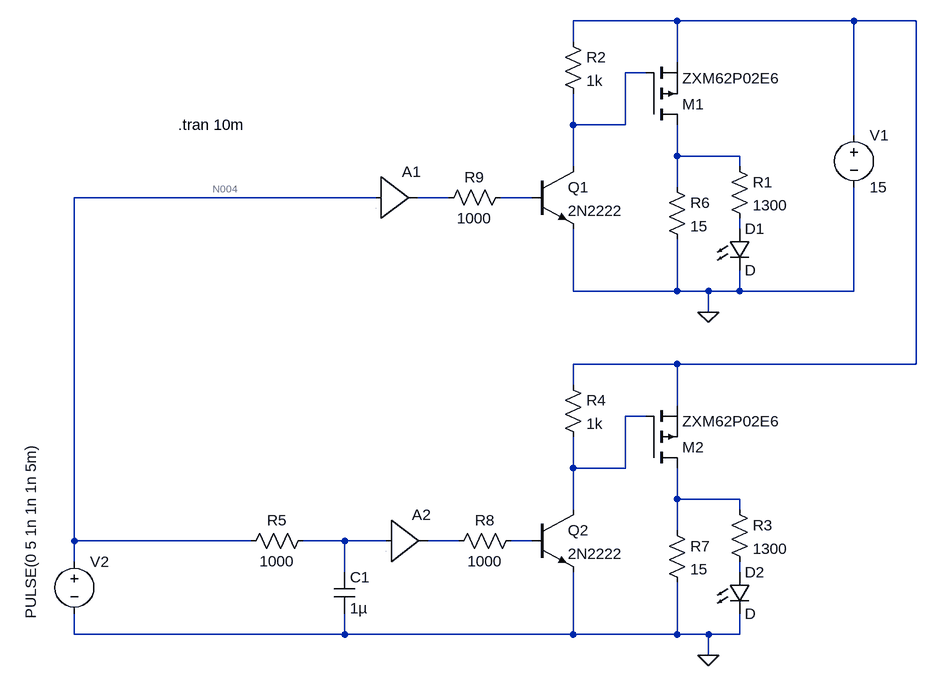
[diagram p0: schematic dc-contactor-driver-mosfet-p.asc]
dc-contactor-driver-mosfet-p.asc, the LTspice schematic file:
Version 4
SHEET 1 880 1128
WIRE 80 16 -80 16
WIRE 352 16 80 16
WIRE 448 16 352 16
WIRE -80 48 -80 16
WIRE 80 80 80 16
WIRE 32 96 0 96
WIRE -80 176 -80 128
WIRE 0 176 0 96
WIRE 0 176 -80 176
WIRE 352 192 352 16
WIRE 80 224 80 176
WIRE 176 224 80 224
WIRE -80 240 -80 176
WIRE 176 240 176 224
WIRE 80 272 80 224
WIRE -384 288 -848 288
WIRE -272 288 -320 288
WIRE -144 288 -192 288
WIRE 176 336 176 320
WIRE -80 432 -80 336
WIRE 80 432 80 352
WIRE 80 432 -80 432
WIRE 128 432 80 432
WIRE 176 432 176 400
WIRE 176 432 128 432
WIRE 352 432 352 272
WIRE 352 432 176 432
WIRE 128 464 128 432
WIRE 80 544 -80 544
WIRE 448 544 448 16
WIRE 448 544 80 544
WIRE -80 576 -80 544
WIRE 80 608 80 544
WIRE 32 624 0 624
WIRE -80 704 -80 656
WIRE 0 704 0 624
WIRE 0 704 -80 704
WIRE 80 752 80 704
WIRE 176 752 80 752
WIRE -80 768 -80 704
WIRE 176 768 176 752
WIRE 80 800 80 752
WIRE -848 816 -848 288
WIRE -576 816 -848 816
WIRE -432 816 -496 816
WIRE -368 816 -432 816
WIRE -256 816 -304 816
WIRE -144 816 -176 816
WIRE -848 848 -848 816
WIRE -432 864 -432 816
WIRE 176 864 176 848
WIRE -848 960 -848 928
WIRE -432 960 -432 928
WIRE -432 960 -848 960
WIRE -80 960 -80 864
WIRE -80 960 -432 960
WIRE 80 960 80 880
WIRE 80 960 -80 960
WIRE 128 960 80 960
WIRE 176 960 176 928
WIRE 176 960 128 960
WIRE 128 992 128 960
FLAG 128 464 0
FLAG 128 992 0
SYMBOL pmos 32 176 M180
SYMATTR InstName M1
SYMATTR Value ZXM62P02E6
SYMBOL res 160 224 R0
SYMATTR InstName R1
SYMATTR Value 1300
SYMBOL LED 160 336 R0
SYMATTR InstName D1
SYMBOL voltage 352 176 R0
WINDOW 123 0 0 Left 0
WINDOW 39 0 0 Left 0
SYMATTR InstName V1
SYMATTR Value 15
SYMBOL res -96 32 R0
SYMATTR InstName R2
SYMATTR Value 1k
SYMBOL npn -144 240 R0
SYMATTR InstName Q1
SYMATTR Value 2N2222
SYMBOL pmos 32 704 M180
SYMATTR InstName M2
SYMATTR Value ZXM62P02E6
SYMBOL res 160 752 R0
SYMATTR InstName R3
SYMATTR Value 1300
SYMBOL LED 160 864 R0
SYMATTR InstName D2
SYMBOL res -96 560 R0
SYMATTR InstName R4
SYMATTR Value 1k
SYMBOL npn -144 768 R0
SYMATTR InstName Q2
SYMATTR Value 2N2222
SYMBOL Digital\\buf1 -368 752 R0
WINDOW 3 0 0 Invisible 0
SYMATTR Value Vhigh = 5,Vt = 1.4, Vh = 0.8
SYMATTR InstName A2
SYMBOL res -480 800 R90
WINDOW 0 0 56 VBottom 2
WINDOW 3 32 56 VTop 2
SYMATTR InstName R5
SYMATTR Value 1000
SYMBOL cap -448 864 R0
SYMATTR InstName C1
SYMATTR Value 1µ
SYMBOL voltage -848 832 R0
WINDOW 3 -67 -166 VRight 2
WINDOW 123 0 0 Left 0
WINDOW 39 0 0 Left 0
SYMATTR Value PULSE(0 5 1n 1n 1n 5m)
SYMATTR InstName V2
SYMBOL res 64 256 R0
SYMATTR InstName R6
SYMATTR Value 15
SYMBOL res 64 784 R0
SYMATTR InstName R7
SYMATTR Value 15
SYMBOL res -272 832 R270
WINDOW 0 32 56 VTop 2
WINDOW 3 0 56 VBottom 2
SYMATTR InstName R8
SYMATTR Value 1000
SYMBOL res -288 304 R270
WINDOW 0 32 56 VTop 2
WINDOW 3 0 56 VBottom 2
SYMATTR InstName R9
SYMATTR Value 1000
SYMBOL Digital\\buf1 -384 224 R0
WINDOW 3 0 0 Invisible 0
SYMATTR Value Vhigh = 5,Vt = 1.4, Vh = 0.8
SYMATTR InstName A1
TEXT -688 176 Left 2 !.tran 10m

The netlist it stands for:
* dc-contactor-driver-mosfet-p.asc
M1 N003 N002 N001 N001 ZXM62P02E6
R1 N003 N007 1300
D1 N007 0 D
V1 N001 0 15
R2 N001 N002 1k
Q1 N002 N006 0 0 2N2222
M2 N009 N008 N001 N001 ZXM62P02E6
R3 N009 N013 1300
D2 N013 0 D
R4 N001 N008 1k
Q2 N008 N012 0 0 2N2222
A2 N010 0 0 0 0 0 N011 0 BUF Vhigh = 5,Vt = 1.4, Vh = 0.8
R5 N010 N004 1000
C1 N010 0 1µ
V2 N004 0 PULSE(0 5 1n 1n 1n 5m)
R6 N003 0 15
R7 N009 0 15
R8 N011 N012 1000
R9 N005 N006 1000
A1 N004 0 0 0 0 0 N005 0 BUF Vhigh = 5,Vt = 1.4, Vh = 0.8
.model D D
.lib standard.dio
.model NPN NPN
.model PNP PNP
.lib standard.bjt
.model NMOS NMOS
.model PMOS PMOS
.lib standard.mos
.tran 10m
.backanno
.end

* Results of the author's LTspice run, read from the files saved beside the schematic
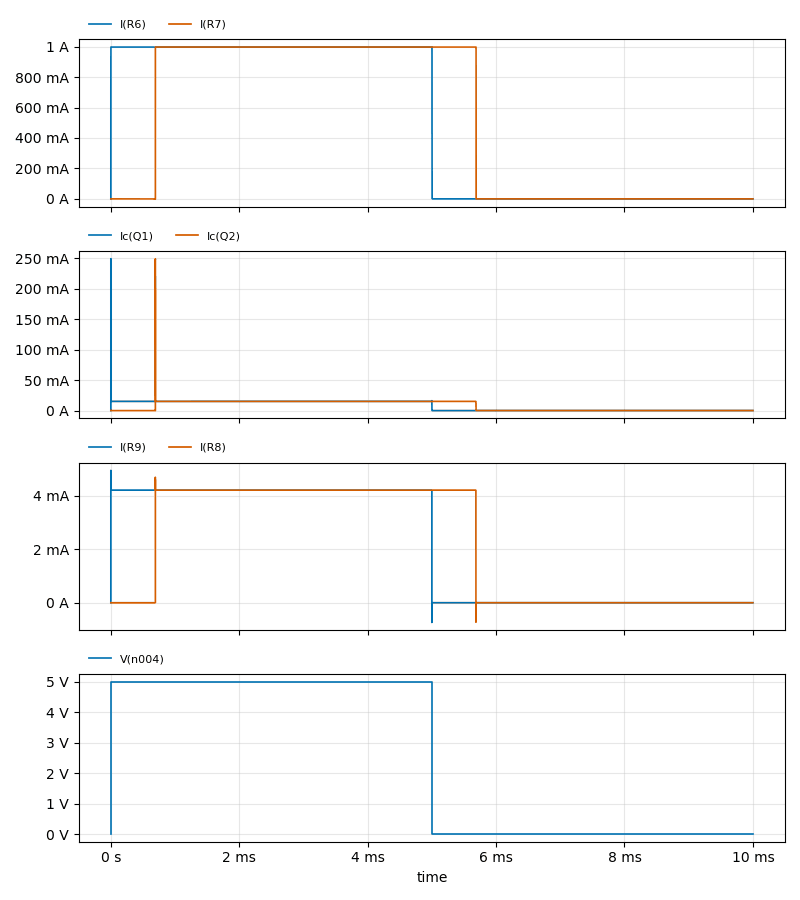
[diagram p1: Transient Analysis of dc-contactor-driver-mosfet-p.asc, plotted from the saved traces]
* Transient Analysis, 1 run:
*   I(R6): min -1.37 mA, max 997.6 mA, average 499.1 mA, rms 705.6 mA, last 0 A
*   I(R7): min -2.006 mA, max 997.6 mA, average 498.4 mA, rms 705.1 mA, last 0 A
*   Ic(Q1): min -511.9 µA, max 249.3 mA, average 7.485 mA, rms 10.6 mA, last 0 A
*   Ic(Q2): min -429.6 µA, max 249.2 mA, average 7.475 mA, rms 10.59 mA, last 0 A
*   I(R9): min -737.9 µA, max 4.944 mA, average 2.102 mA, rms 2.973 mA, last 0 A
*   I(R8): min -727.4 µA, max 4.684 mA, average 2.099 mA, rms 2.971 mA, last 0 A
*   V(n004): min 0 V, max 5 V, average 2.5 V, rms 3.536 V, last 0 V